# Altium project DACN.PrjPcb
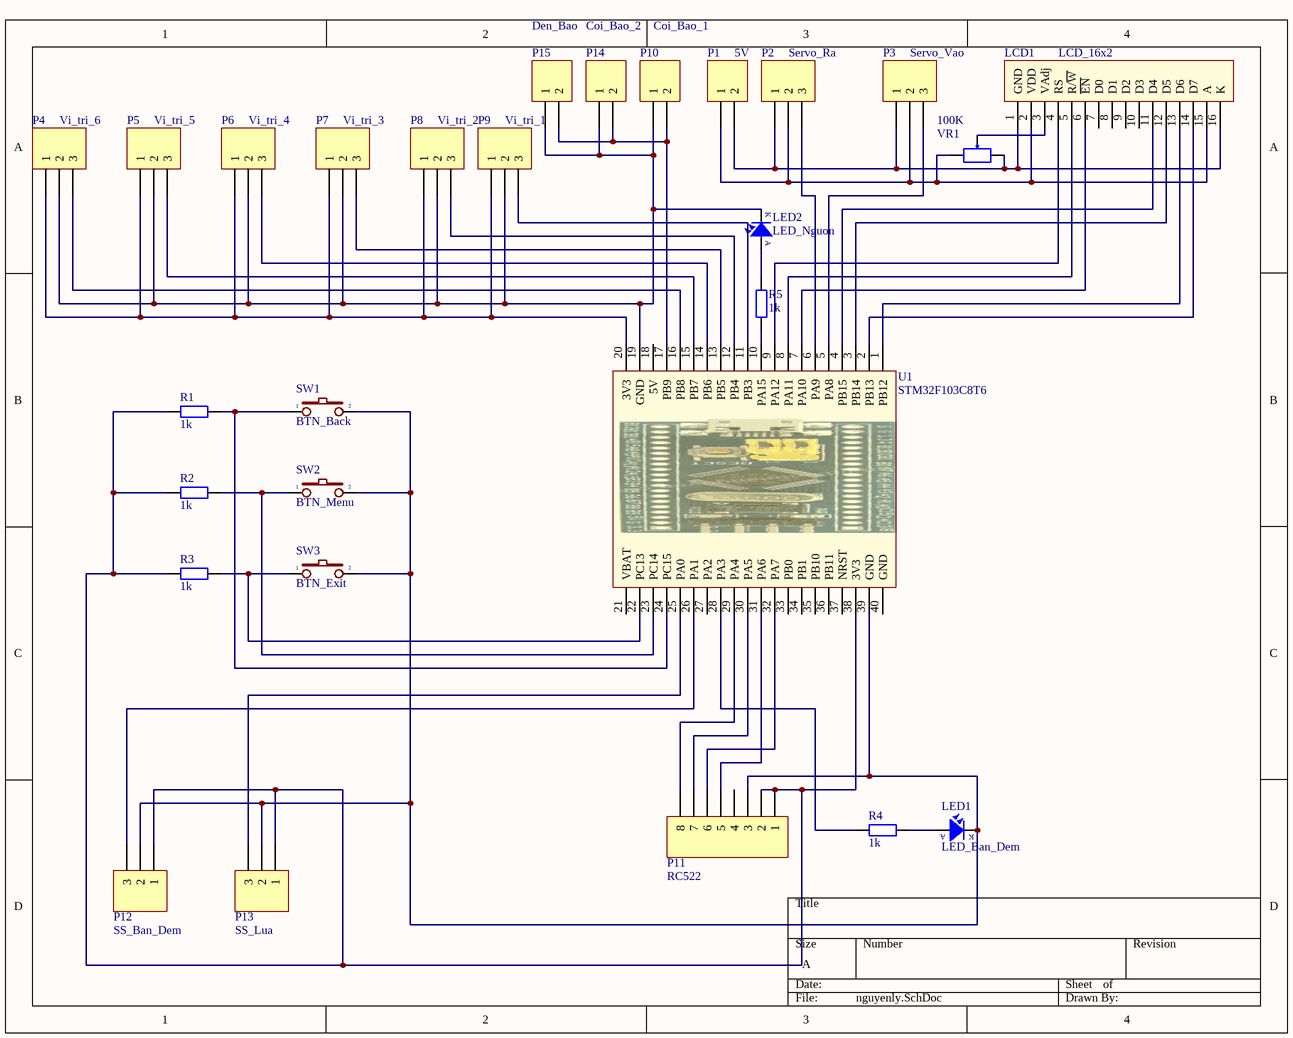
[diagram p0: nguyenly.SchDoc]
1 sheet, 28 parts. Net scope: global (net labels, ports and power ports of the same name join across sheets).
Board file: machin.PcbDoc

## Sheet nguyenly.SchDoc
size A

### Parts
LCD1  LCD_16x2  [LCD16X2]
LED1  LED_Ban_Dem  [LED-5]
LED2  LED_Nguon  [LED-5]
P1  5V  [HDR1X2]
P2  Servo_Ra  [HDR1X3]
P3  Servo_Vao  [HDR1X3]
P4  Vi_tri_6  [HDR1X3]
P5  Vi_tri_5  [HDR1X3]
P6  Vi_tri_4  [HDR1X3]
P7  Vi_tri_3  [HDR1X3]
P8  Vi_tri_2  [HDR1X3]
P9  Vi_tri_1  [HDR1X3]
P10  Coi_Bao_1  [HDR1X2]
P11  RC522  [HDR1X8]
P12  SS_Ban_Dem  [HDR1X3]
P13  SS_Lua  [HDR1X3]
P14  Coi_Bao_2  [HDR1X2]
P15  Den_Bao  [HDR1X2]
R1  1k  [R1/4W]
R2  1k  [R1/4W]
R3  1k  [R1/4W]
R4  1k  [R1/4W]
R5  1k  [R1/4W]
SW1  BTN_Back  [SW2]
SW2  BTN_Menu  [SW2]
SW3  BTN_Exit  [SW2]
U1  STM32F103C8T6  [STM32L103C8_mini]
VR1  100K  [VR]

### Nets
NetLCD1_1: LCD1.1(GND) LCD1.16(K) P1.2 P2.1 P3.1 VR1.3
NetLCD1_2: LCD1.2(VDD) LCD1.15(A) P1.1 P2.2 P3.2 VR1.1
NetLCD1_3: LCD1.3(VAdj) VR1.2
NetLCD1_4: LCD1.4(RS) U1.9(PA12)
NetLCD1_5: LCD1.5(R/~{W}) U1.8(PA11)
NetLCD1_6: LCD1.6(~{EN}) U1.7(PA10)
NetLCD1_11: LCD1.11(D4) U1.4(PB15)
NetLCD1_12: LCD1.12(D5) U1.3(PB14)
NetLCD1_13: LCD1.13(D6) U1.1(PB12)
NetLCD1_14: LCD1.14(D7) U1.2(PB13)
NetLED1_1: LED1.1(A) R4.2
NetLED1_2: LED1.2(K) P11.3 P12.2 P13.2 SW1.2 SW2.2 SW3.2 U1.39(GND)
NetLED2_1: LED2.1(A) R5.2
NetLED2_2: LED2.2(K) P4.2 P5.2 P6.2 P7.2 P8.2 P9.2 P10.1 P14.1 P15.1 U1.19(GND)
NetP2_3: P2.3 U1.6(PA9)
NetP3_3: P3.3 U1.5(PA8)
NetP4_1: P4.1 P5.1 P6.1 P7.1 P8.1 P9.1 U1.20(3V3)
NetP4_3: P4.3 U1.16(PB8)
NetP5_3: P5.3 U1.15(PB7)
NetP6_3: P6.3 U1.14(PB6)
NetP7_3: P7.3 U1.13(PB5)
NetP8_3: P8.3 U1.12(PB4)
NetP9_3: P9.3 U1.11(PB3)
NetP10_2: P10.2 P14.2 P15.2 U1.17(PB9)
NetP11_1: P11.1 P11.2 P12.1 P13.1 R1.1 R2.1 R3.1 U1.38(3V3)
NetP11_5: P11.5 U1.31(PA6)
NetP11_6: P11.6 U1.32(PA7)
NetP11_7: P11.7 U1.30(PA5)
NetP11_8: P11.8 U1.29(PA4)
NetP12_3: P12.3 U1.26(PA1)
NetP13_3: P13.3 U1.25(PA0)
NetR1_2: R1.2 SW1.1 U1.24(PC15)
NetR2_2: R2.2 SW2.1 U1.23(PC14)
NetR3_2: R3.2 SW3.1 U1.22(PC13)
NetR4_1: R4.1 U1.28(PA3)
NetR5_1: R5.1 U1.10(PA15)

Not connected (* = marked no-connect by the designer): LCD1 7(D0) 8(D1) 9(D2) 10(D3); P11 4; U1 18(5V) 21(VBAT) 27(PA2) 33(PB0) 34(PB1) 35(PB10) 36(PB11) 37(NRST) 40(GND)

### Library data of the parts
LCD1 = LCD16x2: LCD dipslay 16 char, 2 line; Value: LCD16x2A
LED1 LED2 = LED: LED Single colour Green and Red; Value: LED 3 ly Single Colour
P1 P10 P14 P15 = Header 2: Header, 2-Pin; LatestRevisionDate: 17-Jul-2002; LatestRevisionNote: Re-released for DXP Platform.; Publisher: Altium Limited
P2-P9 P12 P13 = Header 3: Header, 3-Pin; LatestRevisionDate: 17-Jul-2002; LatestRevisionNote: Re-released for DXP Platform.; Publisher: Altium Limited
P11 = Header 8: Header, 8-Pin; LatestRevisionDate: 17-Jul-2002; LatestRevisionNote: Re-released for DXP Platform.; Publisher: Altium Limited
R1-R5 = R1/4W: Resistor 1/4W; Value: R1/4W - 1K
SW1-SW3 = SW2: Switch button 2 pin; Value: SW chip 2 pin
U1 = STM32L103C8_mini: STM32F103C8T6 Mini Board
VR1 = VR: Var Resistor; Value: VR 10K